# EAGLE design sd2iec (EAGLE 4.13)
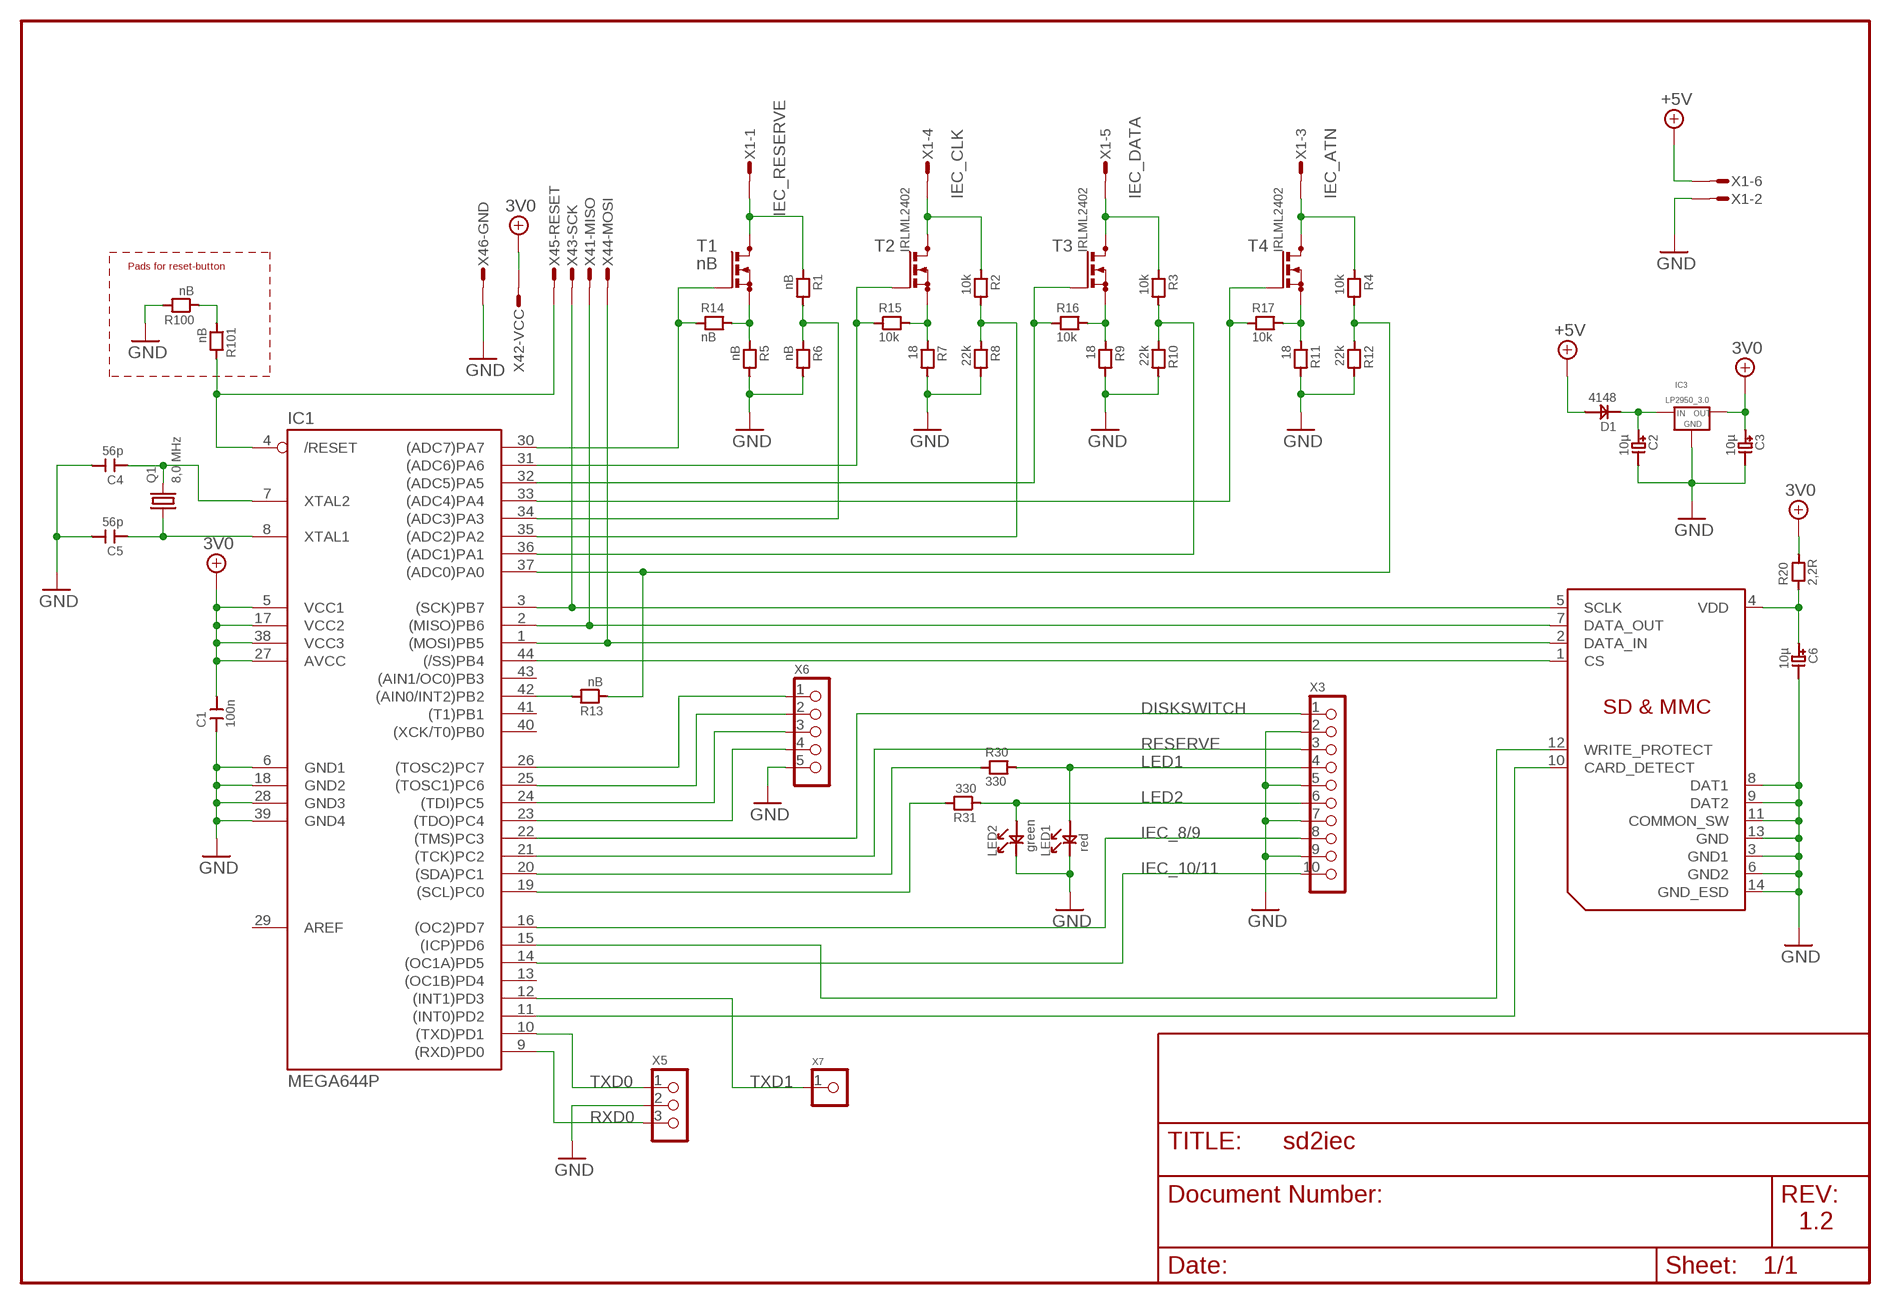
[diagram p0: schematic, sheet 1]

## Parts
C1  100n  C1206  [C1206]
C2  10µ  C_POLTA_A  [C_TANTAL_A]
C3  10µ  C_POLTA_A  [C_TANTAL_A]
C4  56p  C1206  [C1206]
C5  56p  C1206  [C1206]
C6  10µ  C_POLTA_A  [C_TANTAL_A]
D1  4148  DSOD-123  [SOD-123]
IC1  MEGA644P  MEGA16/32TQFP  [TQFP44]
IC3  LP2950_3.0  LP2950_TO92S  [TO92_S]
LED1  red  LED1206  [LED1206]
LED2  green  LED1206  [LED1206]
Q1  8,0 MHz  HC49  [HC49/S]
R1  nB  R1206  [R1206]
R2  10k  R1206  [R1206]
R3  10k  R1206  [R1206]
R4  10k  R1206  [R1206]
R5  nB  R1206  [R1206]
R6  nB  R1206  [R1206]
R7  18  R1206  [R1206]
R8  22k  R1206  [R1206]
R9  18  R1206  [R1206]
R10  22k  R1206  [R1206]
R11  18  R1206  [R1206]
R12  22k  R1206  [R1206]
R13  nB  R0603  [R0603]
R14  nB  R0805  [R0805]
R15  10k  R0805  [R0805]
R16  10k  R0805  [R0805]
R17  10k  R0805  [R0805]
R20  2,2R  R1206  [R1206]
R30  330  R1206  [R1206]
R31  330  R1206  [R1206]
R100  nB  R1206  [R1206]
R101  nB  R1206  [R1206]
T1  nB  BSN20_C  [SOT23_C]
T2  IRLML2402  BSN20_C  [SOT23_C]
T3  IRLML2402  BSN20_C  [SOT23_C]
T4  IRLML2402  BSN20_C  [SOT23_C]
X1  MICROMATCH-6_PIN  [MICROMATCH-6]
X2  SD_SCDA1A1401  [ALPS_SCDA1A1401]
X3  PINH1X10  [1X10]
X4  AVR-ISP_1X6  [1X6_ISP]
X5  PINH1X3  [1X3]
X6  PINH1X52,54  [1X5]
X7  PINH1X1  [1X1]

## Nets
3V0: C1.2 C3.1 IC1.5(VCC1) IC1.17(VCC2) IC1.27(AVCC) IC1.38(VCC3) IC3.3(OUT) R20.2 X4.2
+5V: D1.2 X1.6
/RESET: IC1.4(/RESET) R101.2 X4.5
ATN: IC1.37((ADC0)PA0) R4.2 R12.1 R13.1
CD: IC1.11((INT0)PD2) X2.10(CARD_DETECT)
CLK: IC1.35((ADC2)PA2) R2.2 R8.1
DATA: IC1.36((ADC1)PA1) R3.2 R10.1
DISKSWITCH: IC1.22((TMS)PC3) X3.1
GND: C1.1 C2.2 C3.2 C4.2 C5.2 C6.2 IC1.6(GND1) IC1.18(GND2) IC1.28(GND3) IC1.39(GND4) IC3.2(GND) LED1.1 LED2.1 R5.2 R6.2 R7.2 R8.2 R9.2 R10.2 R11.2 R12.2 R100.2 X1.2 X2.3(GND1) X2.6(GND2) X2.8(DAT1) X2.9(DAT2) X2.11(COMMON_SW) X2.13(GND) X2.14(GND_ESD) X3.2 X3.5 X3.7 X3.9 X4.6 X5.2 X6.5
IEC_8/9: IC1.16((OC2)PD7) X3.8
IEC_10/11: IC1.14((OC1A)PD5) X3.10
IEC_ATN: R4.1 T4.3(D) X1.3
IEC_CLK: R2.1 T2.3(D) X1.4
IEC_DATA: R3.1 T3.3(D) X1.5
IEC_RESERVE: R1.1 T1.3(D) X1.1
IECRESERVE: IC1.34((ADC3)PA3) R1.2 R6.1
LED1: LED1.2 R30.2 X3.4
LED2: LED2.2 R31.1 X3.6
MISO: IC1.2((MISO)PB6) X2.7(DATA_OUT) X4.1
MOSI: IC1.1((MOSI)PB5) X2.2(DATA_IN) X4.4
N$1: IC1.23((TDO)PC4) X6.4
N$2: C2.1 D1.1 IC3.1(IN)
N$3: IC1.42((AIN0/INT2)PB2) R13.2
N$4: C5.1 IC1.8(XTAL1) Q1.1
N$5: C4.1 IC1.7(XTAL2) Q1.2
N$6: C6.1 R20.1 X2.4(VDD)
N$7: IC1.24((TDI)PC5) X6.3
N$11: IC1.25((TOSC1)PC6) X6.2
N$12: IC1.26((TOSC2)PC7) X6.1
N$17: IC1.32((ADC5)PA5) R16.1 T3.1(G)
N$18: R100.1 R101.1
N$19: IC1.33((ADC4)PA4) R17.1 T4.1(G)
N$20: IC1.31((ADC6)PA6) R15.1 T2.1(G)
N$21: IC1.30((ADC7)PA7) R14.1 T1.1(G)
N$22: R5.1 R14.2 T1.2(S)
N$23: R7.1 R15.2 T2.2(S)
N$24: R9.1 R16.2 T3.2(S)
N$25: R11.1 R17.2 T4.2(S)
PC0: IC1.19((SCL)PC0) R31.2
PC1: IC1.20((SDA)PC1) R30.1
RESERVE: IC1.21((TCK)PC2) X3.3
RXD0: IC1.9((RXD)PD0) X5.3
SCK: IC1.3((SCK)PB7) X2.5(SCLK) X4.3
SS: IC1.44((/SS)PB4) X2.1(CS)
TXD0: IC1.10((TXD)PD1) X5.1
TXD1: IC1.12((INT1)PD3) X7.1
WP: IC1.15((ICP)PD6) X2.12(WRITE_PROTECT)
Unconnected: IC1.13((OC1B)PD4) IC1.29(AREF) IC1.40((XCK/T0)PB0) IC1.41((T1)PB1) IC1.43((AIN1/OC0)PB3)

## Notes on the sheet
- Pads for reset-button
- 1.2

## Library data of the parts
C1 C4 C5 = 0_rr:C
C2 C3 C6 = 0_rr:C_POL
D1 = 0_rr:D
IC1 = 0_rr:MEGA16/32: MICROCONTROLLER 16 Kbytes FLASH, 512 bytes EEPROM 1 Kbytes SRAM dual UART hardware multiplier
IC3 = 0_rr:LP2950
LED1 LED2 = 0_rr:LED
Q1 = 0_rr:HC49
R1-R17 R20 R30 R31 R100 R101 = 0_rr:R
T1-T4 = 0_rr:BSN20: N-CHANNEL MOS FET
X1 = 0_rr:MICROMATCH-6: MicroMaTch 6 7-215464-6 / 0-215464-6 Drawing Number C-215464 DDEController.pdf
X2 = 0_rr:SD
X3 = 0_rr:PINH1X10
X4 = 0_rr:AVR-ISP: MicroMaTch 6 7-215464-6 / 0-215464-6 Drawing Number C-215464 DDEController.pdf
X5 = 0_rr:PINH1X3
X6 = 0_rr:PINH1X5
X7 = 0_rr:PINH1X1

## Board
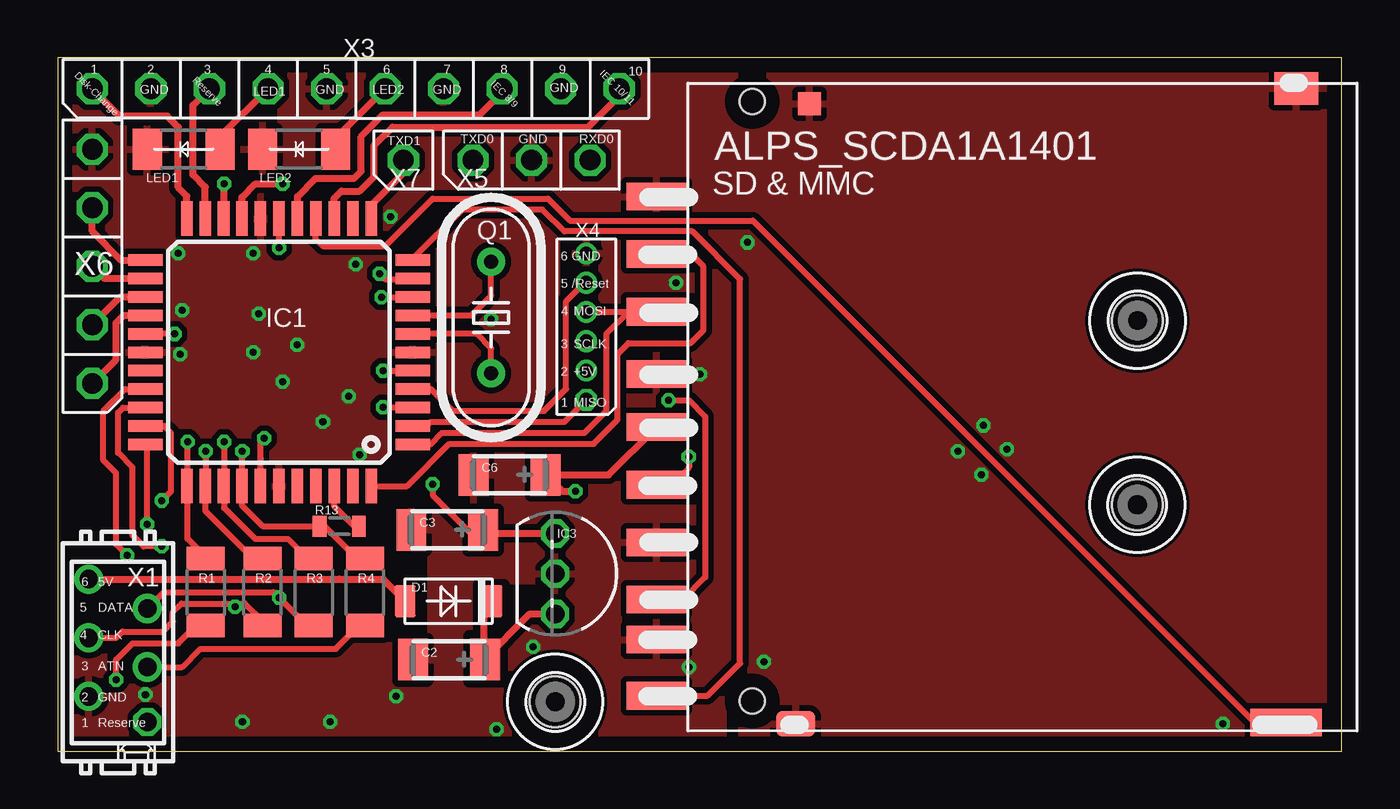
[diagram p1: board, top side]
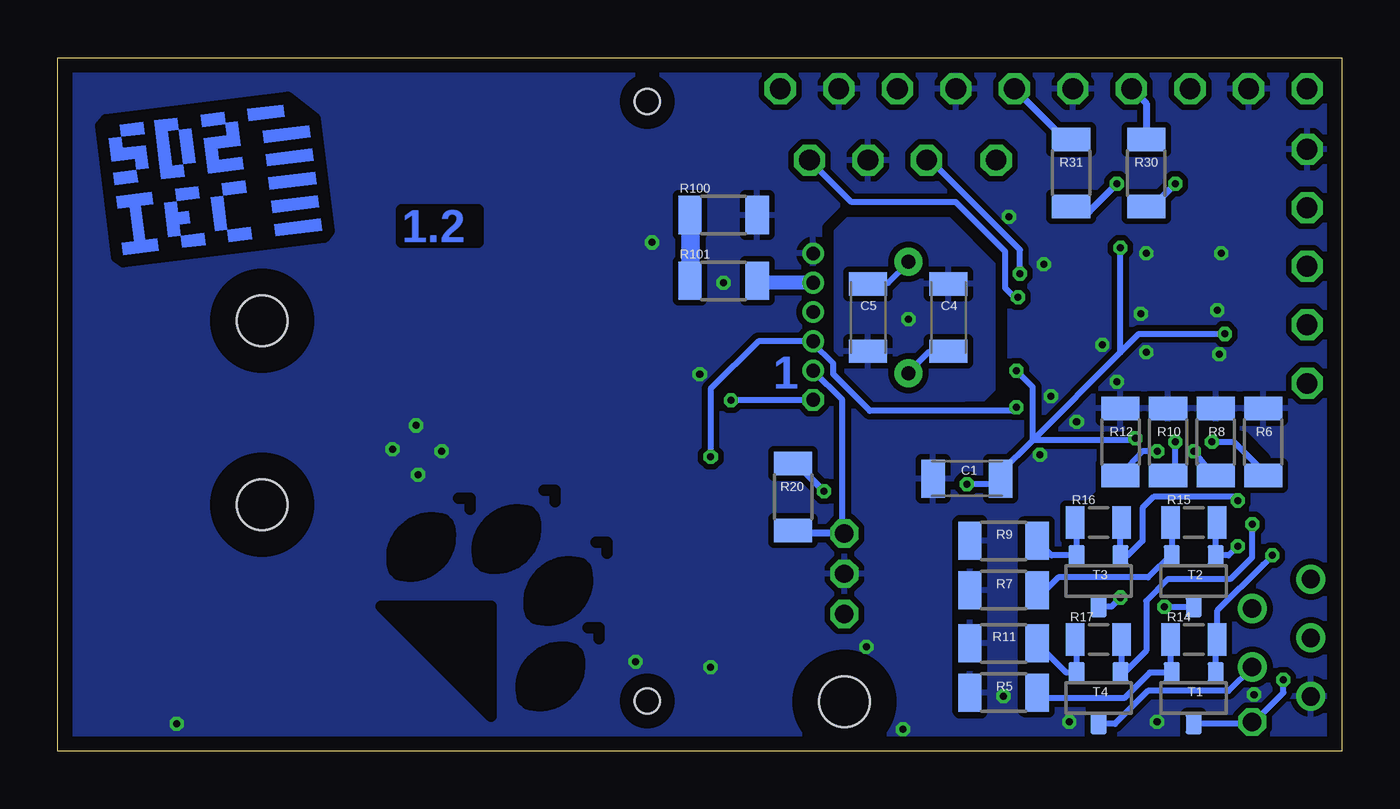
[diagram p2: board, bottom side, seen from below]

Size 55.72 x 30.08 mm. Coordinates in mm from the lower left corner, seen from the top.
Outline: 0,0 55.72,0 55.72,30.08 0,30.08 0,0
Copper layers (1*16): Top 0.035mm / dielectric 1.5mm / Bottom 0.035mm
Design rules "default": minimum track width 8mil, minimum drill 12mil, track to track 8mil, track to pad 8mil, pad to pad 8mil, via to via 8mil, smd to smd 8mil, copper to edge 25mil, drill to drill 8mil, minimum pad ring 6mil, minimum via ring 6mil, stop-mask expansion 4mil, vias tented up to drill 12mil, thermal gap 10mil
tRestrict: 30 lines
bRestrict: 22 lines

### Footprints (pad centres in the part's own frame; a part is rotated, then mirrored left to right if it is on the bottom)
C1206 = smd 1.016 x 1.651: 1 -1.462,0; 2 1.462,0
C_TANTAL_A = smd 1.3 x 1.8: 1 1.559,0; 2 -1.559,0
SOD-123 = smd 0.914 x 1.397: 1 -1.884,0; 2 1.884,0
TQFP44 = smd 1.5 x 0.5: 1 -5.8,4; 2 -5.8,3.2; 3 -5.8,2.4; 4 -5.8,1.6; 5 -5.8,0.8; 6 -5.8,0; 7 -5.8,-0.8; 8 -5.8,-1.6; 9 -5.8,-2.4; 10 -5.8,-3.2; 11 -5.8,-4; 23 5.8,-4; 24 5.8,-3.2; 25 5.8,-2.4; 26 5.8,-1.6; 27 5.8,-0.8; 28 5.8,0; 29 5.8,0.8; 30 5.8,1.6; 31 5.8,2.4; 32 5.8,3.2; 33 5.8,4 | smd 0.5 x 1.5: 12 -4,-5.8; 13 -3.2,-5.8; 14 -2.4,-5.8; 15 -1.6,-5.8; 16 -0.8,-5.8; 17 0,-5.8; 18 0.8,-5.8; 19 1.6,-5.8; 20 2.4,-5.8; 21 3.2,-5.8; 22 4,-5.8; 34 4,5.8; 35 3.2,5.8; 36 2.4,5.8; 37 1.6,5.8; 38 0.8,5.8; 39 0,5.8; 40 -0.8,5.8; 41 -1.6,5.8; 42 -2.4,5.8; 43 -3.2,5.8; 44 -4,5.8
TO92_S = drill 0.8 pad 1.219 octagon: 1 1.746,0; 2 0,0; 3 -1.746,0
LED1206 = smd 1.27 x 1.778: 1 -1.581,0; 2 1.581,0
HC49/S = drill 0.6 pad 1.219 round: 1 -2.413,0; 2 2.413,0
R1206 = smd 1.016 x 1.651: 1 -1.454,0; 2 1.454,0
R0603 = smd 0.6 x 0.9: 1 -0.85,0; 2 0.85,0
R0805 = smd 0.8 x 1.4: 1 -1.009,0; 2 1.009,0
SOT23_C = smd 0.7 x 0.9: 1 -0.953,-1.111; 2 0.953,-1.111; 3 0,1.111
2,2 = hole 2.2: 0,0
MICROMATCH-6 = drill 0.8 pad 1.118 octagon: 1 3.016,1.27 | drill 0.8 pad 1.27 round: 2 1.905,-1.27; 3 0.635,1.27; 4 -0.635,-1.27; 5 -1.905,1.27; 6 -3.175,-1.27
ALPS_SCDA1A1401 = smd 2.6 x 1.2: 1 -4.176,6.875; 2 -4.176,4.375; 3 -4.176,1.675; 4 -4.176,-0.625; 5 -4.176,-3.125; 6 -4.176,-5.625; 7 -4.176,-8.109; 8 -4.176,-9.841; 9 -4.176,9.37; 10 -4.176,-12.275 | smd 1.7 x 1.1: 11 1.865,-13.49 | smd 3.1 x 1.2: 12 23.137,-13.441 | smd 1.9 x 1.4: 13 23.576,14.062 | smd 1 x 1: 14 2.463,13.399 | hole 1.1: -0.02,13.495; -0.019,-12.505
1X10 = drill 0.9 octagon: 1 -11.43,0; 2 -8.89,0; 3 -6.35,0; 4 -3.81,0; 5 -1.27,0; 6 1.27,0; 7 3.81,0; 8 6.35,0; 9 8.89,0; 10 11.43,0
1X6_ISP = drill 0.6 pad 0.94 octagon: 1 0,0 | drill 0.6 pad 0.94 round: 2 1.27,0; 3 2.54,0; 4 3.81,0; 5 5.08,0; 6 6.35,0
1X3 = drill 0.9 octagon: 1 -2.54,0; 2 0,0; 3 2.54,0
1X5 = drill 0.9 octagon: 1 -5.08,0; 2 -2.54,0; 3 0,0; 4 2.54,0; 5 5.08,0
1X1 = drill 0.9 pad 1.27 octagon: 1 0,0

### Placement (x,y rotation side)
C1  16.27,11.83 0 bottom
C2  16.99,3.97 0 top
C3  16.91,9.6 0 top
C4  17.07,18.81 90 bottom
C5  20.56,18.81 270 bottom
C6  19.61,11.99 0 top
D1  16.96,6.51 180 top
IC1  9.6,17.3 180 top
IC3  21.59,7.7 270 top
LED1  5.48,26.11 0 top
LED2  10.48,26.11 0 top
Q1  18.81,18.81 270 top
R1  6.43,6.91 90 top
R2  8.89,6.91 90 top
R3  11.11,6.91 90 top
R4  13.34,6.91 90 top
R5  14.68,2.54 180 bottom
R6  3.41,13.41 90 bottom
R7  14.68,6.99 180 bottom
R8  5.48,13.41 90 bottom
R9  14.68,9.13 180 bottom
R10  7.54,13.41 90 bottom
R11  14.68,4.68 180 bottom
R12  9.6,13.41 90 bottom
R13  12.22,9.76 0 top
R14  6.43,4.84 180 bottom
R15  6.43,9.92 180 bottom
R16  10.56,9.92 180 bottom
R17  10.56,4.84 180 bottom
R20  23.81,11.03 270 bottom
R30  8.49,25.08 90 bottom
R31  11.75,25.08 270 bottom
R100  26.83,23.26 0 bottom
R101  26.83,20.4 0 bottom
T1  6.43,2.3 180 bottom
T2  6.43,7.38 180 bottom
T3  10.56,7.38 180 bottom
T4  10.56,2.3 180 bottom
U$1  [2,2]  46.86,18.68 0 top
U$2  [LOGO_B]  36.38,6.82 45 top
U$3  [2,2]  46.84,10.69 0 top
U$4  [2,2]  21.59,2.14 0 top
U$5  [SD2IEC_LOGO]  48.97,24.77 7 bottom
X1  2.62,4.29 270 top
X2  30.16,14.68 0 top
X3  12.94,28.73 0 top
X4  22.94,15.24 90 top
X5  20.56,25.64 0 top
X6  1.51,21.03 90 top
X7  15,25.64 0 top

### Tracks (layer width: path | path; a pad name or v marks a point on that pad's centre or on a via)
3V0  (via drill 0.3)
  Top 0.254: IC1.5 v14.13,16.51 | IC1.38 8.8,11.44 8.81,11.43 8.81,12.7 8.81,13.41 v8.97,13.57 | IC1.27 v5.07,18.1 v5.08,18.1 | 18.49,9.53 18.47,9.53 17.86,9.53 16.51,10.87 16.27,11.11 v16.27,11.59 | v9.6,21.83 IC1.17
  Top 0.305: C3.1 18.47,9.53 18.55,9.45 IC3.3
  Bottom 0.254: v5.08,18.1 8.81,18.1 9.6,17.3 | 13.41,13.49 9.6,17.3 | v14.13,16.51 13.41,15.8 13.41,13.49 | X4.2 21.67,15.24 21.67,11.27 21.67,9.53 IC3.3 | v8.97,13.57 9.13,13.49 9.45,13.49 13.41,13.49 | 9.6,17.3 v9.6,21.83 | 13.41,13.49 14.81,12.1 C1.2 14.84,11.83 | 14.84,11.83 | v16.27,11.59 15.08,11.59 14.84,11.83
  Bottom 0.305: R20.2 23.81,9.45 IC3.3
+5V
  Top 0.305: X1.6 12.22,7.46 | 12.22,7.46 13.18,7.46 | D1.2 14.13,7.46 12.22,7.46
/RESET
  Top 0.254: IC1.4 15.42,15.72 16.19,15.72 17.14,14.76 21.11,14.76 22.07,15.72 22.07,19.53 22.86,20.32 X4.5 | X4.5 | X4.5
  Bottom 0.305: 25.25,20.32 R101.2 | X4.5
  Bottom 0.61: X4.5 25.25,20.32
ATN  (via drill 0.3)
  Top 0.254: R4.2 13.02,8.33 11.59,9.76 11.27,9.76 | 11.27,9.76 8.89,9.76 8.01,10.65 IC1.37 8.02,11.51 v8.02,13.02 | 11.27,9.76 R13.1
  Bottom 0.254: R12.1 8.63,13.02 v8.02,13.02
CD
  Top 0.254: X2.10 28.21,2.41 29.61,3.81 29.61,20.48 27.54,22.54 21.99,22.54 21.03,23.5 17.54,23.5 15.4,21.36 IC1.11
CLK  (via drill 0.3)
  Top 0.254: R2.2 8.41,8.41 7.62,9.21 6.4,10.42 IC1.35 6.5,11.5 6.43,11.51 v6.43,13.02
  Bottom 0.254: R8.1 5.48,11.83 v6.43,13.02
DATA  (via drill 0.3)
  Top 0.254: v7.22,13.41 7.22,11.52 IC1.36 7.22,11.51 7.22,10.56 8.57,9.21 10,9.21 10.85,8.36 R3.2
  Bottom 0.254: R10.1 7.22,11.91 v7.22,13.41
DISKSWITCH
  Top 0.254: X3.1
  Top 0.305: IC1.22 5.6,24.08 5.24,24.45 5.24,27.07 4.76,27.54 2.7,27.54 X3.1
GND  (via drill 0.3)
  other vias: 39.05,13.02 40.08,11.99 40.16,14.13 41.2,13.1 20.64,4.52 13.1,12.86 5.24,21.59 12.94,21.11 5.32,17.22 29.92,22.07 26.83,20.32 27.86,16.35 14.45,23.18 11.51,14.29 27.38,3.65 18.81,18.73 50.56,1.19 30.64,3.89 19.05,0.95 14.68,2.38 8.02,1.27 3.81,2.46 11.83,1.27 12.62,15.4 8.73,18.97 8.49,21.59 5.4,19.13 10.4,17.62 9.76,16.03 8.49,17.3
  pour Top (isolate 0.254): 0,0 0,30.08 55.72,30.08 55.72,0
  pour Bottom (isolate 0.254): 0,0 0,30.08 55.72,30.08 55.72,0
IEC_8/9
  Top 0.305: IC1.16 10.4,24.06 11.19,24.84 12.86,24.84 13.18,25.16 13.18,26.67 14.1,27.6 18.31,27.6 19.29,28.57 X3.8 | X3.8
IEC_10/11
  Top 0.305: IC1.14 12.01,23.99 12.3,24.29 13.1,24.29 13.73,24.92 13.73,26.27 14.53,27.07 23.02,27.07 24.37,28.42 X3.10 | X3.10
IEC_ATN
  Top 0.254: X1.3 5.4,3.65 6.19,4.45 12.06,4.45 13.1,5.48 13.26,5.48 R4.1
  Bottom 0.254: T4.3 9.84,1.19 8.41,2.62 4.92,2.62 X1.3 | X1.3 | X1.3
IEC_CLK  (via drill 0.3)
  Top 0.254: X1.4 2.54,4.92 2.8,5.18 4.55,5.18 5,5.64 5,6.03 5.37,6.4 7.7,6.4 | R2.1 8.89,5.64 8.12,6.4 7.7,6.4 | 7.7,6.4 v7.7,6.27
  Bottom 0.254: v7.7,6.27 T2.3
IEC_DATA  (via drill 0.3)
  Top 0.254: X1.5 4.6,6.91 9.37,6.91 v9.6,6.67 | v9.6,6.67 | R3.1 10.82,5.45 v9.6,6.67
  Bottom 0.254: T3.3 10,6.27 v9.6,6.67
IEC_RESERVE  (via drill 0.3)
  Top 0.254: R1.1 6.04,5.48 5.24,4.68 3.25,4.68 2.54,3.97 v2.54,3.1
  Bottom 0.254: 3.81,1.27 | X1.1 3.81,1.27 | 3.81,1.27 2.54,2.54 v2.54,3.1 2.54,3.02 | X1.1 | T1.3 3.97,1.19 X1.1
IECRESERVE  (via drill 0.3)
  Top 0.254: R1.2 6.44,8.41 5.64,9.21 5.64,11.51 | 5.64,11.51 5.64,11.59 5.6,11.56 IC1.34 5.64,11.51 | 5.64,11.51 v5.64,13.41
  Bottom 0.254: R6.1 3.41,12.14 4.68,13.41 v5.64,13.41
LED1
  Top 0.305: X3.4 | LED1.2 7.06,26.66 X3.4
  Bottom 0.305: X3.4 | R30.2 8.49,28.1 X3.4
LED2
  Top 0.305: X3.6 | LED2.2 12.06,26.58 X3.6
  Bottom 0.305: X3.6 | R31.1 12.01,26.54 X3.6
MISO  (via drill 0.3)
  Top 0.254: IC1.2 15.43,14.13 16.03,14.13 16.19,14.29 21.99,14.29 X4.1 | X4.1 | X4.1 | X2.7 27.13,6.58 28.1,7.54 28.1,14.53 27.41,15.21 v26.51,15.21
  Bottom 0.254: X4.1 22.94,15.21 v26.51,15.21 | X4.1
MOSI
  Top 0.254: X4.4 | 24.77,19.05 X4.4 | 24.77,19.05 25.96,19.05 | 25.96,19.05 25.98,19.05 X2.2 25.96,19.06 25.96,19.05 | IC1.1 16.16,13.3 16.67,13.81 22.86,13.81 23.81,14.76 23.81,18.1 24.77,19.05
N$1
  Top 0.305: IC1.23 2.75,21.3 1.51,22.54 X6.4 | X6.4 | X6.4 1.51,23.65
N$2
  Top 0.305: D1.1 18.49,6.15 18.49,3.97 | C2.1 18.49,3.97 | IC3.1 20.48,5.95 18.49,3.97
N$3
  Top 0.254: R13.2 12.86,9.76 12.01,10.62 IC1.42
N$4
  Top 0.254: IC1.8 17.95,18.9 18.81,19.76 Q1.1 18.81,21.27
  Bottom 0.254: Q1.1 18.81,21.19 19.69,20.31 C5.1
N$5
  Top 0.254: IC1.7 18.17,18.1 18.81,17.46 Q1.2
  Bottom 0.254: Q1.2 18.81,16.43 17.93,17.31 C4.1
N$6  (via drill 0.3)
  Top 0.305: X2.4 23.91,11.99 C6.1 21.11,12.06 21.91,11.27 v22.46,11.27
  Bottom 0.305: R20.1 23.81,12.61 v22.46,11.27
N$7
  Top 0.305: X6.3 2.04,20.5 IC1.24
N$11
  Top 0.305: X6.2 | IC1.25 2.72,19.7 X6.2
N$12
  Top 0.305: IC1.26 2.87,18.9 2.54,18.57 2.54,16.99 X6.1 | X6.1
N$17  (via drill 0.3)
  Top 0.254: IC1.32 4.63,14.1 4.92,13.81 4.92,11.27 v4.52,10.87 | v4.52,10.87
  Bottom 0.254: v4.52,10.87 | v4.52,10.87 4.68,11.03 8.18,11.03 8.65,10.56 8.65,9.13 9.29,8.49 T3.1 | T3.1 | R16.1 9.6,9.87 T3.1
N$18
  Bottom 0.813: R101.1 28.26,20.4 28.26,23.26 R100.1
N$19  (via drill 0.3)
  Top 0.254: IC1.33 3.89,13.38 v3.89,9.84
  Bottom 0.254: v3.89,9.84 3.89,8.41 4.84,7.46 7.54,7.46 8.49,6.51 8.49,4.37 9.45,3.41 9.53,3.41 | 9.53,3.41 T4.1 | R17.1 9.55,3.44 9.53,3.41
N$20  (via drill 0.3)
  Top 0.254: IC1.31 2.84,14.9 2.62,14.68 2.62,12.94 3.25,12.3 3.25,9.37 3.73,8.89 v4.52,8.89
  Bottom 0.254: v4.52,8.89 4.92,8.49 T2.1 | T2.1 | T2.1 | R15.1 5.48,9.87 T2.1
N$21  (via drill 0.3)
  Top 0.254: IC1.30 2.92,15.7 1.98,14.76 1.98,12.62 2.54,12.06 2.54,8.97 v3.02,8.49
  Bottom 0.254: v3.02,8.49 3.41,8.1 5.4,6.11 5.4,4.84 R14.1 5.42,4.74 5.48,4.68 T1.1
N$22
  Bottom 0.254: 7.44,3.36 T1.2 8.34,3.41 9.45,2.3 13.18,2.3 13.23,2.36 R5.1 | R14.2 7.44,3.36 | 7.44,3.36 7.46,3.33
N$23
  Bottom 0.254: R7.1 12.86,6.99 12.3,7.54 8.41,7.54 7.38,8.57 7.38,8.81 T2.2 7.38,9.87 R15.2
N$24
  Bottom 0.254: R9.1 12.6,8.49 T3.2 | T3.2 | T3.2 | R16.2 11.51,9.87 T3.2
N$25
  Bottom 0.254: R11.1 11.96,3.41 T4.2 | T4.2 | T4.2 | R17.2 11.51,4.79 T4.2
PC0  (via drill 0.3)
  Top 0.305: 8.02,23.12 IC1.19 8.01,24.04 8.57,24.61 v9.76,24.61
  Bottom 0.305: R31.2 11.75,23.42 10.95,23.42 v9.76,24.61
PC1  (via drill 0.3)
  Top 0.305: IC1.20 7.22,23.12 v7.22,24.61
  Bottom 0.305: R30.1 8.41,23.42 v7.22,24.61
RESERVE
  Top 0.254: X3.3
  Top 0.305: IC1.21 6.4,24.47 5.87,25 5.87,28.02 X3.3
RXD0  (via drill 0.3)
  Top 0.254: IC1.9 15.39,19.68 v14.05,19.68
  Bottom 0.254: v14.05,19.68 14.21,19.68 14.61,20.08 14.61,21.67 16.75,23.81 21.27,23.81 X5.3
SCK  (via drill 0.3)
  Top 0.254: X2.5 26.51,11.56 26.59,11.51 27.38,12.3 v27.38,12.78 | IC1.3 15.39,14.92 v14.13,14.92
  Bottom 0.254: X4.3 | X4.3 | v14.13,14.92 14.29,14.76 20.48,14.76 22.07,16.35 22.07,16.83 22.94,17.7 X4.3 | X4.3 | v27.38,12.78 27.38,15.72 25.32,17.78 X4.3 | X4.3 | X4.3
SS
  Top 0.254: IC1.44 15.15,11.5 16.99,13.34 23.26,13.34 24.29,14.37 24.29,17.22 24.77,17.7 27.46,17.7 28.02,18.26 28.02,21.03 27.46,21.59 25.96,21.59 X2.1 | X2.1
TXD0  (via drill 0.3)
  Top 0.254: IC1.10 15.38,20.48 14.21,20.48 v13.97,20.72
  Bottom 0.254: v13.97,20.72 13.97,21.75 16.75,24.53 17.86,25.64 X5.1
TXD1
  Top 0.305: IC1.12 13.6,23.68 15,25.08 X7.1
WP
  Top 0.254: IC1.15 11.2,22.21 11.51,21.91 14.21,21.91 16.27,23.97 21.27,23.97 22.23,23.02 30.16,23.02 52.03,1.15 | 52.03,1.15 53.34,1.11 | 52.03,1.15 X2.12

### Text on the board
Bottom: 1.2 | 1
tPlace: 1 | 2 | Reserve | 3 | 4 | 5 | 6 | 7 | IEC 8/9 | 8 | GND | 9 | IEC 10/11 | 10 | Disk-Change | GND | LED1 | GND | LED2 | GND | TXD1 | TXD0 | GND | RXD0 | 6 | GND | 5 | /Reset | 4 | MOSI | 3 | SCLK | 2 | +5V | 1 | MISO | 6 | 5V | 5 | DATA | 4 | CLK | 3 | ATN | 2 | GND | 1 | Reserve